# EAGLE schematic FPGA_DENDY_SE (EAGLE 9.4.2)
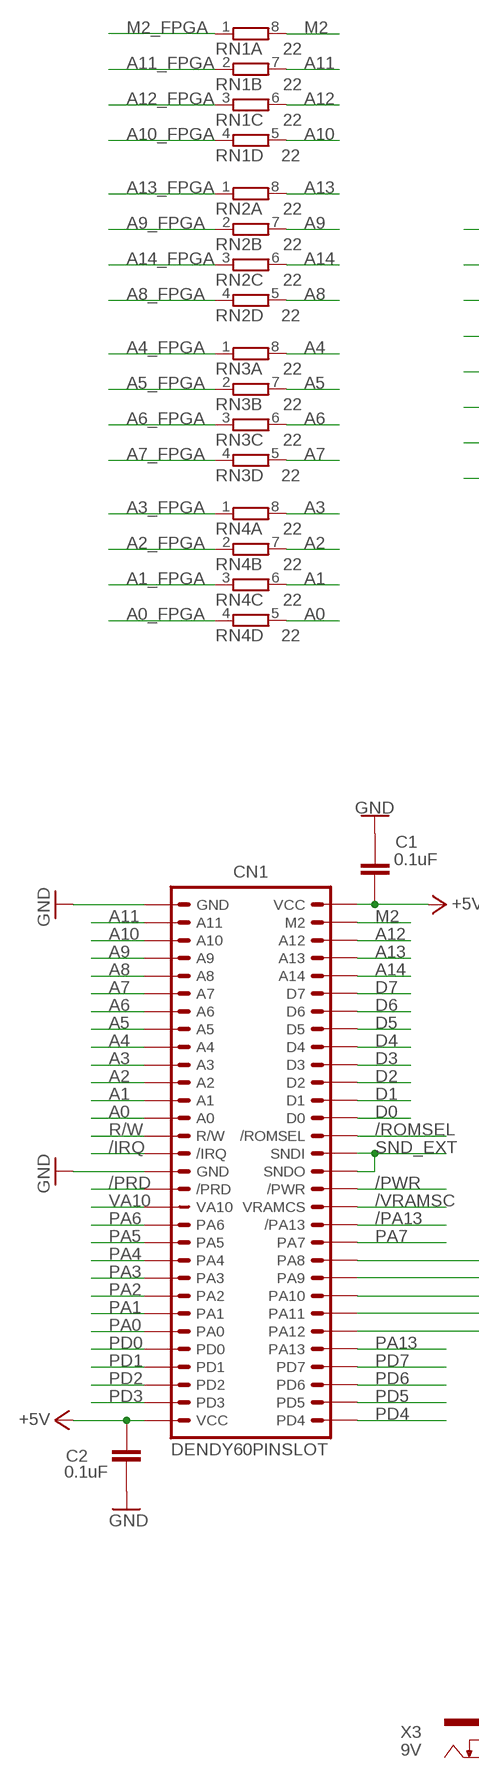
[diagram p0: schematic, sheet 1, part 1 of 2]
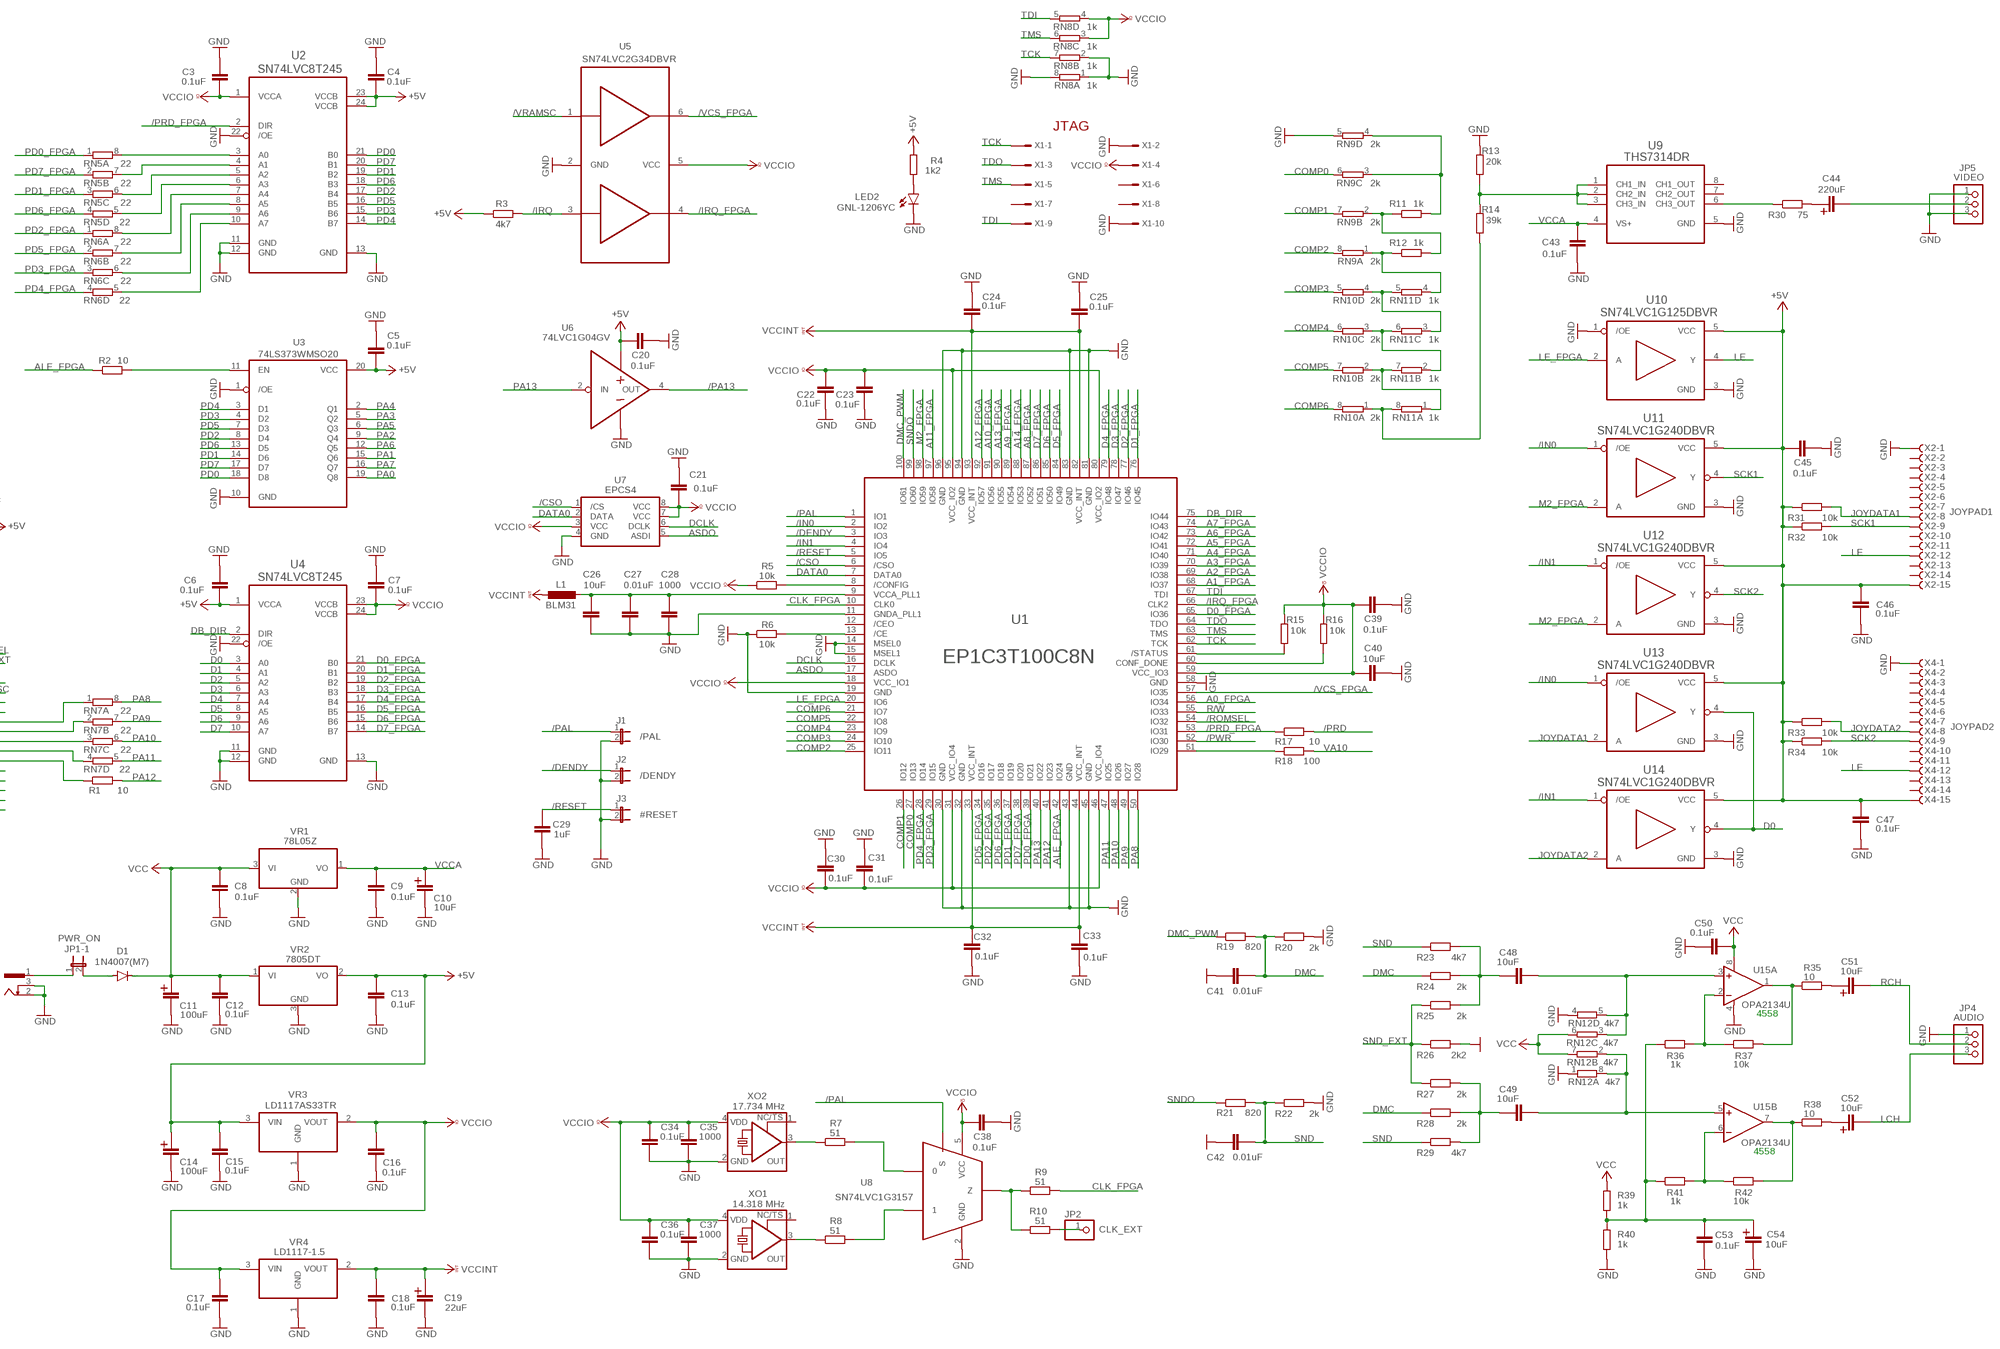
[diagram p1: schematic, sheet 1, part 2 of 2]

## Parts
C1  0.1uF  C-EUC0805  [C0805]
C2  0.1uF  C-EUC0805  [C0805]
C3  0.1uF  C-EUC0805  [C0805]
C4  0.1uF  C-EUC0805  [C0805]
C5  0.1uF  C-EUC0805  [C0805]
C6  0.1uF  C-EUC0603  [C0603]
C7  0.1uF  C-EUC0603  [C0603]
C8  0.1uF  C-EUC0805  [C0805]
C9  0.1uF  C-EUC0805  [C0805]
C10  10uF  CPOL-EU153CLV-0505  [153CLV-0505]
C11  100uF  CPOL-EU153CLV-0505  [153CLV-0505]
C12  0.1uF  C-EUC0805  [C0805]
C13  0.1uF  C-EUC0805  [C0805]
C14  100uF  CPOL-EU153CLV-0505  [153CLV-0505]
C15  0.1uF  C-EUC0805  [C0805]
C16  0.1uF  C-EUC0805  [C0805]
C17  0.1uF  C-EUC0805  [C0805]
C18  0.1uF  C-EUC0805  [C0805]
C19  22uF  CPOL-EU153CLV-0505  [153CLV-0505]
C20  0.1uF  C-EUC0603  [C0603]
C21  0.1uF  C-EUC0603  [C0603]
C22  0.1uF  C-EUC0603  [C0603]
C23  0.1uF  C-EUC0603  [C0603]
C24  0.1uF  C-EUC0603  [C0603]
C25  0.1uF  C-EUC0603  [C0603]
C26  10uF  C-EUC0603  [C0603]
C27  0.01uF  C-EUC0603  [C0603]
C28  1000  C-EUC0603  [C0603]
C29  1uF  C-EUC0603  [C0603]
C30  0.1uF  C-EUC0603  [C0603]
C31  0.1uF  C-EUC0603  [C0603]
C32  0.1uF  C-EUC0603  [C0603]
C33  0.1uF  C-EUC0603  [C0603]
C34  0.1uF  C-EUC0805  [C0805]
C35  1000  C-EUC0805  [C0805]
C36  0.1uF  C-EUC0805  [C0805]
C37  1000  C-EUC0805  [C0805]
C38  0.1uF  C-EUC0603  [C0603]
C39  0.1uF  C-EUC0603  [C0603]
C40  10uF  C-EUC0603  [C0603]
C41  0.01uF  C-EUC0805  [C0805]
C42  0.01uF  C-EUC0805  [C0805]
C43  0.1uF  C-EUC0603  [C0603]
C44  220uF  CPOL-EU153CLV-0505  [153CLV-0505]
C45  0.1uF  C-EUC0603  [C0603]
C46  0.1uF  C-EUC0805  [C0805]
C47  0.1uF  C-EUC0805  [C0805]
C48  10uF  C-EUC0805  [C0805]
C49  10uF  C-EUC0805  [C0805]
C50  0.1uF  C-EUC0805  [C0805]
C51  10uF  CPOL-EU153CLV-0505  [153CLV-0505]
C52  10uF  CPOL-EU153CLV-0505  [153CLV-0505]
C53  0.1uF  C-EUC0805  [C0805]
C54  10uF  CPOL-EU153CLV-0505  [153CLV-0505]
CN1  DENDY60PINSLOT  [60PINDENDY]
D1  1N4007(M7)  DIODE-DO-214AC  [DO-214AC]
J1  /PAL  JP1E  [JP1]
J2  /DENDY  JP1E  [JP1]
J3  #RESET  JP1E  [JP1]
JP1  PWR_ON  JP4QE  [JP4Q]
JP2  CLK_EXT  PINHD-1X1  [1X01]
JP4  AUDIO  PINHD-1X3  [1X03]
JP5  VIDEO  PINHD-1X3  [1X03]
L1  BLM31  L-EUL0201  [L0201]
LED2  GNL-1206YC  LEDSML1206  [SML1206]
R1  10  R-EU_R0805  [R0805]
R2  10  R-EU_R0805  [R0805]
R3  4k7  R-EU_R0805  [R0805]
R4  1k2  R-EU_R0805  [R0805]
R5  10k  R-EU_R0805  [R0805]
R6  10k  R-EU_R0805  [R0805]
R7  51  R-EU_R0805  [R0805]
R8  51  R-EU_R0805  [R0805]
R9  51  R-EU_R0805  [R0805]
R10  51  R-EU_R0805  [R0805]
R11  1k  R-EU_R0805  [R0805]
R12  1k  R-EU_R0805  [R0805]
R13  20k  R-EU_R0805  [R0805]
R14  39k  R-EU_R0805  [R0805]
R15  10k  R-EU_R0805  [R0805]
R16  10k  R-EU_R0805  [R0805]
R17  10  R-EU_R0805  [R0805]
R18  100  R-EU_R0805  [R0805]
R19  820  R-EU_R0805  [R0805]
R20  2k  R-EU_R0805  [R0805]
R21  820  R-EU_R0805  [R0805]
R22  2k  R-EU_R0805  [R0805]
R23  4k7  R-EU_R0805  [R0805]
R24  2k  R-EU_R0805  [R0805]
R25  2k  R-EU_R0805  [R0805]
R26  2k2  R-EU_R0805  [R0805]
R27  2k  R-EU_R0805  [R0805]
R28  2k  R-EU_R0805  [R0805]
R29  4k7  R-EU_R0805  [R0805]
R30  75  R-EU_R0805  [R0805]
R31  10k  R-EU_R0805  [R0805]
R32  10k  R-EU_R0805  [R0805]
R33  10k  R-EU_R0805  [R0805]
R34  10k  R-EU_R0805  [R0805]
R35  10  R-EU_R0805  [R0805]
R36  1k  R-EU_R0805  [R0805]
R37  10k  R-EU_R0805  [R0805]
R38  10  R-EU_R0805  [R0805]
R39  1k  R-EU_R0805  [R0805]
R40  1k  R-EU_R0805  [R0805]
R41  1k  R-EU_R0805  [R0805]
R42  10k  R-EU_R0805  [R0805]
RN1  22  4R-N0603-ARC  [0603-ARC]
RN2  22  4R-N0603-ARC  [0603-ARC]
RN3  22  4R-N0603-ARC  [0603-ARC]
RN4  22  4R-N0603-ARC  [0603-ARC]
RN5  22  4R-N0603-ARC  [0603-ARC]
RN6  22  4R-N0603-ARC  [0603-ARC]
RN7  22  4R-N0603-ARC  [0603-ARC]
RN8  1k  4R-N0603-ARC  [0603-ARC]
RN9  2k  4R-N0603-ARC  [0603-ARC]
RN10  2k  4R-N0603-ARC  [0603-ARC]
RN11  1k  4R-N0603-ARC  [0603-ARC]
RN12  4k7  4R-N0603-ARC  [0603-ARC]
U1  EP1C3T100C8N  [QFP50P1600X1600X120-100N]
U2  SN74LVC8T245  [SOP65P640X110-24N]
U3  74LS373WMSO20  [SO20W]
U4  SN74LVC8T245  [SOP65P640X110-24N]
U5  SN74LVC2G34DBVR  [SOT-23-6]
U6  74LVC1G04GV  [SOT95P275X110-5N]
U7  EPCS4  [SO08]
U8  SN74LVC1G3157  [SOT-23-6]
U9  THS7314DR  THS7314  [SO8]
U10  SN74LVC1G125DBVR  [SOT95P280X145-5N]
U11  SN74LVC1G240DBVR  [SOT95P280X145-5N]
U12  SN74LVC1G240DBVR  [SOT95P280X145-5N]
U13  SN74LVC1G240DBVR  [SOT95P280X145-5N]
U14  SN74LVC1G240DBVR  [SOT95P280X145-5N]
U15  OPA2134U  [SO08]
VR1  78L05Z  [TO92]
VR2  7805DT  [TO252]
VR3  LD1117AS33TR  [SOT230P700X180-4N]
VR4  LD1117-1.5  [SOT-223-3]
X1  057-010-1  [057-010-1]
X2  JOYPAD1  F15HPS  [F15HP]
X3  9V  733980-62  [733980-62]
X4  JOYPAD2  F15HPS  [F15HP]
XO1  14.318 MHz  KXO-PXO/XO-V97  [7.0X5.08_KXO-(V)97]
XO2  17.734 MHz  KXO-PXO/XO-V95  [2.5X2.0_KXO-V95]

## Nets
+5V: C1.2 C2.1 C4.2 C5.2 C6.1 C13.1 C14.+ C15.1 C20.2 C45.2 C46.1 C47.1 CN1.A30(VCC) CN1.B1(VCC) R3.1 R4.2 R31.1 R32.1 R33.1 R34.1 U2.23(VCCB) U2.24(VCCB) U3.20(VCC) U4.1(VCCA) U6.5(VCC) U10.5(VCC) U11.5(VCC) U12.5(VCC) U13.5(VCC) U14.5(VCC) VR2.2(VO) VR3.3(VIN) X2.15(-15:F) X4.15(-15:F)
/CSO: U1.6(/CSO) U7.1(/CS)
/DENDY: J2.1 U1.3(IO3)
/IN0: U1.2(IO2) U11.1(/OE) U13.1(/OE)
/IN1: U1.4(IO4) U12.1(/OE) U14.1(/OE)
/IRQ: CN1.A15(/IRQ) R3.2 U5.3(IN2)
/IRQ_FPGA: U1.66(CLK2) U5.4(OUT2)
/PA13: CN1.B19(/PA13) U6.4(OUT)
/PAL: J1.1 U1.1(IO1) U8.6(S)
/PRD: CN1.A17(/PRD) R17.2
/PRD_FPGA: R17.1 U1.53(IO31) U2.2(DIR)
/PWR: CN1.B17(/PWR) U1.52(IO30)
/PWR_FPGA: R18.1 U1.51(IO29)
/RESET: C29.2 J3.1 U1.5(IO5)
/ROMSEL: CN1.B14(/ROMSEL) U1.54(IO32)
/VCS_FPGA: U1.57(IO35) U5.6(OUT1)
/VRAMSC: CN1.B18(VRAMCS) U5.1(IN1)
A0: CN1.A13(A0) RN4.5
A0_FPGA: RN4.4 U1.56(IO34)
A1: CN1.A12(A1) RN4.6
A1_FPGA: RN4.3 U1.68(IO37)
A2: CN1.A11(A2) RN4.7
A2_FPGA: RN4.2 U1.69(IO38)
A3: CN1.A10(A3) RN4.8
A3_FPGA: RN4.1 U1.70(IO39)
A4: CN1.A9(A4) RN3.8
A4_FPGA: RN3.1 U1.71(IO40)
A5: CN1.A8(A5) RN3.7
A5_FPGA: RN3.2 U1.72(IO41)
A6: CN1.A7(A6) RN3.6
A6_FPGA: RN3.3 U1.73(IO42)
A7: CN1.A6(A7) RN3.5
A7_FPGA: RN3.4 U1.74(IO43)
A8: CN1.A5(A8) RN2.5
A8_FPGA: RN2.4 U1.87(IO52)
A9: CN1.A4(A9) RN2.7
A9_FPGA: RN2.2 U1.89(IO54)
A10: CN1.A3(A10) RN1.5
A10_FPGA: RN1.4 U1.91(IO56)
A11: CN1.A2(A11) RN1.7
A11_FPGA: RN1.2 U1.97(IO58)
A12: CN1.B3(A12) RN1.6
A12_FPGA: RN1.3 U1.92(IO57)
A13: CN1.B4(A13) RN2.8
A13_FPGA: RN2.1 U1.90(IO55)
A14: CN1.B5(A14) RN2.6
A14_FPGA: RN2.3 U1.88(IO53)
ALE_FPGA: R2.1 U1.42(IO24)
ASDO: U1.17(ASDO) U7.5(ASDI)
CLK_FPGA: R9.2 U1.10(CLK0)
COMP0: RN9.6 U1.27(IO13)
COMP1: RN9.7 U1.26(IO12)
COMP2: RN9.8 U1.25(IO11)
COMP3: RN10.5 U1.24(IO10)
COMP4: RN10.6 U1.23(IO9)
COMP5: RN10.7 U1.22(IO8)
COMP6: RN10.8 U1.21(IO7)
D0: CN1.B13(D0) U4.3(A0) U13.4(Y) U14.4(Y)
D0_FPGA: U1.65(IO36) U4.21(B0)
D1: CN1.B12(D1) U4.4(A1)
D1_FPGA: U1.76(IO45) U4.20(B1)
D2: CN1.B11(D2) U4.5(A2)
D2_FPGA: U1.77(IO46) U4.19(B2)
D3: CN1.B10(D3) U4.6(A3)
D3_FPGA: U1.78(IO47) U4.18(B3)
D4: CN1.B9(D4) U4.7(A4)
D4_FPGA: U1.79(IO48) U4.17(B4)
D5: CN1.B8(D5) U4.8(A5)
D5_FPGA: U1.84(IO49) U4.16(B5)
D6: CN1.B7(D6) U4.9(A6)
D6_FPGA: U1.85(IO50) U4.15(B6)
D7: CN1.B6(D7) U4.10(A7)
D7_FPGA: U1.86(IO51) U4.14(B7)
DATA0: U1.7(DATA0) U7.2(DATA)
DB_DIR: U1.75(IO44) U4.2(DIR)
DCLK: U1.16(DCLK) U7.6(DCLK)
DMC: C41.2 R19.2 R20.1 R24.1 R28.1
DMC_PWM: R19.1 U1.100(IO61)
GND: C1.1 C2.2 C3.1 C4.1 C5.1 C6.2 C7.2 C8.2 C9.2 C10.- C11.- C12.2 C13.2 C14.- C15.2 C16.2 C17.2 C18.2 C19.- C20.1 C21.2 C22.1 C23.1 C24.2 C25.2 C26.1 C27.1 C28.1 C29.1 C30.2 C31.2 C32.1 C33.1 C34.2 C35.2 C36.2 C37.2 C38.1 C39.1 C40.1 C41.1 C42.1 C43.1 C45.1 C46.2 C47.2 C50.1 C53.2 C54.- CN1.A1(GND) CN1.A16(GND) J1.2 J2.2 J3.2 JP4.1 JP5.1 JP5.3 LED2.C R6.1 R13.2 R20.2 R22.2 R26.2 R40.2 RN8.1 RN8.2 RN8.8 RN9.5 RN12.1 RN12.4 U1.11(GNDA_PLL1) U1.14(MSEL0) U1.15(MSEL1) U1.19(GND) U1.30(GND) U1.32(GND) U1.43(GND) U1.45(GND) U1.58(GND) U1.81(GND) U1.83(GND) U1.94(GND) U1.96(GND) U2.11(GND) U2.12(GND) U2.13(GND) U2.22(/OE) U3.1(/OE) U3.10(GND) U4.11(GND) U4.12(GND) U4.13(GND) U4.22(/OE) U5.2(GND) U6.3(GND) U7.4(GND) U8.2(GND) U9.5(GND) U10.1(/OE) U10.3(GND) U11.3(GND) U12.3(GND) U13.3(GND) U14.3(GND) U15.4(A:V-) VR1.2(GND) VR2.3(GND) VR3.1(GND) VR4.1(GND) X1.2 X1.10 X2.1(-1:F) X3.2 X3.3 X4.1(-1:F) XO1.2(GND) XO2.2(GND)
JOYDATA1: R31.2 U13.2(A) X2.8(-8:F)
JOYDATA2: R33.2 U14.2(A) X4.8(-8:F)
LCH: C52.- JP4.3
LE: U10.4(Y) X2.12(-12:F) X4.12(-12:F)
LE_FPGA: U1.20(IO6) U10.2(A)
M2: CN1.B2(M2) RN1.8
M2_FPGA: RN1.1 U1.98(IO59) U11.2(A) U12.2(A)
N$1: R15.1 U1.61(/STATUS)
N$2: R16.1 U1.60(CONF_DONE)
N$3: JP2.1 R10.2
N$4: RN10.2 RN11.1 RN11.7
N$5: R11.2 RN9.3 RN9.4
N$6: R2.2 U3.11(EN)
N$7: RN5.8 U2.3(A0)
N$8: R12.1 RN9.1 RN11.4
N$9: RN10.3 RN11.2 RN11.6
N$10: R6.2 U1.13(/CE)
N$11: R5.2 U1.8(/CONFIG)
N$12: C26.2 C27.2 C28.2 L1.2 U1.9(VCCA_PLL1)
N$13: C52.+ R38.2
N$14: R41.2 R42.1 U15.6(B:-IN)
N$15: D1.A JP1.2
N$16: C48.1 R23.2 R24.2 R25.2
N$17: R8.1 XO1.3(OUT)
N$18: R7.1 XO2.3(OUT)
N$19: RN5.7 U2.4(A1)
N$20: RN5.6 U2.5(A2)
N$21: RN5.5 U2.6(A3)
N$22: RN6.8 U2.7(A4)
N$23: RN6.7 U2.8(A5)
N$24: RN6.6 U2.9(A6)
N$25: RN6.5 U2.10(A7)
N$26: R11.1 R12.2 RN9.2
N$27: CN1.B21(PA8) RN7.1
N$28: R14.1 RN10.1 RN11.8
N$29: CN1.B22(PA9) RN7.2
N$30: C49.1 R27.2 R28.2 R29.2
N$31: CN1.B23(PA10) RN7.3
N$32: CN1.B24(PA11) RN7.4
N$33: CN1.B25(PA12) R1.1
N$34: R30.1 U9.6(CH3_OUT)
N$35: R7.2 U8.3
N$36: C44.+ R30.2
N$37: C51.+ R35.2
N$38: C48.2 RN12.3 RN12.5 U15.3(A:+IN)
N$39: C49.2 RN12.2 RN12.8 U15.5(B:+IN)
N$40: RN10.4 RN11.3 RN11.5
N$41: R13.1 R14.2 U9.1(CH1_IN) U9.2(CH2_IN) U9.3(CH3_IN)
N$42: R36.2 R37.1 U15.2(A:-IN)
N$43: R35.1 R37.2 U15.1(A:OUT)
N$44: R38.1 R42.2 U15.7(B:OUT)
N$45: C44.- JP5.2
N$46: R8.2 U8.1
N$47: R9.1 R10.1 U8.4(Z)
N$63: LED2.A R4.1
N$77: JP1.1 X3.1
PA0: CN1.A25(PA0) U3.19(Q8)
PA1: CN1.A24(PA1) U3.15(Q6)
PA2: CN1.A23(PA2) U3.9(Q4)
PA3: CN1.A22(PA3) U3.5(Q2)
PA4: CN1.A21(PA4) U3.2(Q1)
PA5: CN1.A20(PA5) U3.6(Q3)
PA6: CN1.A19(PA6) U3.12(Q5)
PA7: CN1.B20(PA7) U3.16(Q7)
PA8: RN7.8 U1.50(IO28)
PA9: RN7.7 U1.49(IO27)
PA10: RN7.6 U1.48(IO26)
PA11: RN7.5 U1.47(IO25)
PA12: R1.2 U1.41(IO23)
PA13: CN1.B26(PA13) U1.40(IO22) U6.2(IN)
PD0: CN1.A26(PD0) U2.21(B0) U3.18(D8)
PD0_FPGA: RN5.1 U1.39(IO21)
PD1: CN1.A27(PD1) U2.19(B2) U3.14(D6)
PD1_FPGA: RN5.3 U1.37(IO19)
PD2: CN1.A28(PD2) U2.17(B4) U3.8(D4)
PD2_FPGA: RN6.1 U1.35(IO17)
PD3: CN1.A29(PD3) U2.15(B6) U3.4(D2)
PD3_FPGA: RN6.3 U1.29(IO15)
PD4: CN1.B30(PD4) U2.14(B7) U3.3(D1)
PD4_FPGA: RN6.4 U1.28(IO14)
PD5: CN1.B29(PD5) U2.16(B5) U3.7(D3)
PD5_FPGA: RN6.2 U1.34(IO16)
PD6: CN1.B28(PD6) U2.18(B3) U3.13(D5)
PD6_FPGA: RN5.4 U1.36(IO18)
PD7: CN1.B27(PD7) U2.20(B1) U3.17(D7)
PD7_FPGA: RN5.2 U1.38(IO20)
R/W: CN1.A14(R/W) U1.55(IO33)
RCH: C51.- JP4.2
SCK1: R32.2 U11.4(Y) X2.9(-9:F)
SCK2: R34.2 U12.4(Y) X4.9(-9:F)
SND: C42.2 R21.2 R22.1 R23.1 R29.1
SND_EXT: CN1.B15(SNDI) CN1.B16(SNDO) R25.1 R26.1 R27.1
SNDO: R21.1 U1.99(IO60)
TCK: RN8.7 U1.62(TCK) X1.1
TDI: RN8.5 U1.67(TDI) X1.9
TDO: U1.64(TDO) X1.3
TMS: RN8.6 U1.63(TMS) X1.5
VA10: CN1.A18(VA10) R18.2
VCC: C8.1 C11.+ C12.1 C50.2 D1.C R39.1 RN12.6 RN12.7 U15.8(A:V+) VR1.3(VI) VR2.1(VI)
VCCA: C9.1 C10.+ C43.2 U9.4(VS+) VR1.1(VO)
VCCINT: C18.1 C19.+ C24.1 C25.1 C32.2 C33.2 L1.1 U1.33(VCC_INT) U1.44(VCC_INT) U1.82(VCC_INT) U1.93(VCC_INT) VR4.2(VOUT)
VCCIO: C3.2 C7.1 C16.1 C17.1 C21.1 C22.2 C23.2 C30.1 C31.1 C34.1 C35.1 C36.1 C37.1 C38.2 C39.2 C40.2 R5.1 R15.2 R16.2 RN8.3 RN8.4 U1.18(VCC_IO1) U1.31(VCC_IO4) U1.46(VCC_IO4) U1.59(VCC_IO3) U1.80(VCC_IO2) U1.95(VCC_IO2) U2.1(VCCA) U4.23(VCCB) U4.24(VCCB) U5.5(VCC) U7.3(VCC) U7.7(VCC) U7.8(VCC) U8.5(VCC) VR3.2(VOUT) VR4.3(VIN) X1.4 XO1.4(VDD) XO2.4(VDD)
VPPL3: C53.1 C54.+ R36.1 R39.2 R40.1 R41.1
Unconnected: JP1.3 JP1.4 JP1.5 JP1.6 JP1.7 JP1.8 U1.12(/CEO) U9.7(CH2_OUT) U9.8(CH1_OUT) X1.6 X1.7 X1.8 X2.2(-2:F) X2.3(-3:F) X2.4(-4:F) X2.5(-5:F) X2.6(-6:F) X2.7(-7:F) X2.10(-10:F) X2.11(-11:F) X2.13(-13:F) X2.14(-14:F) X2.G1(-G:G1) X2.G2(-G:G2) X4.2(-2:F) X4.3(-3:F) X4.4(-4:F) X4.5(-5:F) X4.6(-6:F) X4.7(-7:F) X4.10(-10:F) X4.11(-11:F) X4.13(-13:F) X4.14(-14:F) X4.G1(-G:G1) X4.G2(-G:G2) XO1.1(TS) XO2.1(TS)

## Notes on the sheet
- JTAG
- 4558
- 4558

## Library data of the parts
C1-C9 C12 C13 C15-C18 C20-C43 C45-C50 C53 = rcl_my:C-EU: CAPACITOR, European symbol; SPICEPREFIX: C
C10 C11 C14 C19 C44 C51 C52 C54 = rcl_my:CPOL-EU: POLARIZED CAPACITOR, European symbol; SPICEPREFIX: C
CN1 = DENDY60pin:DENDY60PINSLOT
D1 = diode:DIODE-: DIODE
J1-J3 = jumper:JP1E: JUMPER
JP1 = jumper:JP4QE: JUMPER
JP2 = pinhead:PINHD-1X1: PIN HEADER
JP4 JP5 = pinhead:PINHD-1X3: PIN HEADER
L1 = rcl_my:L-EU: INDUCTOR, European symbol; SPICEPREFIX: L
LED2 = led:LED: LED OSRAM: - CHIPLED LG R971, LG N971, LY N971, LG Q971, LY Q971, LO R971, LY R971 LH N974, LH R974 LS Q976, LO Q976, LY Q976 LO Q996 - Hyper CHIPLED LW Q18S LB Q993, LB Q99A, LB R99A - SideLED LS A670, LO A670, LY A670, LG A670, LP A670 LB A673, LV A673, LT A673, LW A673 LH A674 LY A675 LS A676, LA A676, LO A676, LY A676, LW A676 LS A679, LY A679, LG A679 - Hyper Micro SIDELED® LS Y876, LA Y876, LO Y876, LY Y876 LT Y87S - SmartLED LW L88C, LW L88S LB L89C, LB L89S, LG L890 LS L89K, LO L89K, LY L89K LS L896, LA L896, LO L896, LY L896 - TOPLED LS T670, LO T670, LY T670, LG T670, LP T670 LSG T670, LSP T670, LSY T670, LOP T670, LYG T670 LG T671, LOG T671, LSG T671 LB T673, LV T673, LT T673, LW T673 LH T674 LS T676, LA T676, LO T676, LY T676, LB T676, LH T676, LSB T676, LW T676 LB T67C, LV T67C, LT T67C, LS T67K, LO T67K, LY T67K, LW E67C LS E67B, LA E67B, LO E67B, LY E67B, LB E67C, LV E67C, LT E67C LW T67C LS T679, LY T679, LG T679 LS T770, LO T770, LY T770, LG T770, LP T770 LB T773, LV T773, LT T773, LW T773 LH T774 LS E675, LA E675, LY E675, LS T675 LS T776, LA T776, LO T776, LY T776, LB T776 LHGB T686 LT T68C, LB T68C - Hyper Mini TOPLED® LB M676 - Mini TOPLED Santana® LG M470 LS M47K, LO M47K, LY M47K Source: http://www.osram.convergy.de LUXEON: - LUMILED® LXK2-PW12-R00, LXK2-PW12-S00, LXK2-PW14-U00, LXK2-PW14-V00 LXK2-PM12-R00, LXK2-PM12-S00, LXK2-PM14-U00 LXK2-PE12-Q00, LXK2-PE12-R00, LXK2-PE12-S00, LXK2-PE14-T00, LXK2-PE14-U00 LXK2-PB12-K00, LXK2-PB12-L00, LXK2-PB12-M00, LXK2-PB14-N00, LXK2-PB14-P00, LXK2-PB14-Q00 LXK2-PR12-L00, LXK2-PR12-M00, LXK2-PR14-Q00, LXK2-PR14-R00 LXK2-PD12-Q00, LXK2-PD12-R00, LXK2-PD12-S00 LXK2-PH12-R00, LXK2-PH12-S00 LXK2-PL12-P00, LXK2-PL12-Q00, LXK2-PL12-R00 Source: www.luxeon.com KINGBRIGHT: KA-3528ASYC Source: www.kingbright.com
R1-R42 = rcl:R-EU_: RESISTOR, European symbol; SPICEPREFIX: R
RN1-RN12 = resistor-dil:4R-N: Array Chip Resistor Source: RS Component / Phycomp; OC_FARNELL: unknown; OC_NEWARK: unknown
U1 = EP1C3T100C8N:EP1C3T100C8N
U2 U4 = SN74LVC8T245:SN74LVC8T245
U3 = 74LS373WM:74LS373WM
U5 = SN74LVC2G34DBVR:SN74LVC2G34DBVR
U6 = 74LVC1G04GV:74LVC1G04GV
U7 = EPCS4:EPCS4
U8 = SN74LVC1G3157:SN74LVC1G3157
U9 = THS7314DR:THS7314
U10 = SN74LVC1G125DBVR:SN74LVC1G125DBVR
U11-U14 = SN74LVC1G240DBVR:SN74LVC1G240DBVR
U15 = burr-brown:OPA2134: Operational Amplifier; MF: TEXAS INSTRUMENTS; MPN: OPA2134UA; OC_FARNELL: 1206935; OC_NEWARK: 35C1847
VR1 = linear:78*: Positive VOLTAGE REGULATOR Source: http://cache.national.com/ds/LM/LM78L05.pdf http://www.fairchildsemi.com/ds/LM/LM7805.pdf
VR2 = linear stab:78*: Positive VOLTAGE REGULATOR Source: http://cache.national.com/ds/LM/LM78L05.pdf http://www.fairchildsemi.com/ds/LM/LM7805.pdf
VR3 = LD1117AS33TR:LD1117AS33TR
VR4 = LD1117-1.5:LD1117-1.5
X1 = con-panduit:057-010-: CONNECTOR 10-pin series 057 contact pc board low profile headers; OC_FARNELL: unknown; OC_NEWARK: unknown
X2 X4 = con-subd:F15HPS: SUB-D; OC_FARNELL: unknown; OC_NEWARK: unknown
X3 = con-conrad:73398?: FEMALE PRINT CONNECTOR Niedervolt-Steckverbinder Distributor Conrad
XO1 XO2 = crystal-geyer_V1_0:KXO-PXO/XO-V: Clock Oscillator (PXO/XO) MHz : KXO-V - Serie Model Size l/w/h [mm] Frequency Range Frequency Stability Temp. Range [°C] Output AECQ 200 availabel Datasheet KXO-V94 KXO-V94 KXO-V95 KXO-V95 KXO-V96 KXO-V96 KXO-V99 KXO-V99 KXO-97 KXO-V97 KXO-97 - KXO-V97 2.0/1.6/0.80 2.0/1.6/0.80 2.5/2.0/0.82 2.5/2.0/0.82 3.2/2.5/1.2 3.2/2.5/1.2 5.0/3.2/1.2 5.0/3.2/1.2 7.0/5.08/1.3 7.0/5.08/1.3 7.0/5.08/1.3 32,768 kHz 1,0 ~ 80,0 MHz 32,768 kHz 1,0 ~ 70,0 MHz 32,768 kHz 1,0 ~ 156,0 MHz 32,768 kHz 1,0 ~ 200,0 MHz 32,768 kHz 32,768 kHz 1,0 ~ 160,0 MHz ±25 … ±100ppm ±25 … ±100ppm ±25 … ±100ppm ±25 … ±100ppm ±25 … ±100ppm ±25 … ±100ppm ±25 … ±100ppm ±25 … ±100ppm ±25 … ±100ppm ±25 … ±100ppm ±25 … ±100ppm (*) -40°C …+85°C (*) -40°C …+85°C (*) -40°C …+85°C (*) -40°C …+85°C (*) -40°C …+85°C (*) -40°C …+85°C (*) -40°C …+85°C (*) -40°C …+85°C (*) -40°C …+85°C (*) -40°C …+85°C (*) -40°C …+85°C HCMOS HCMOS HCMOS HCMOS HCMOS HCMOS HCMOS HCMOS HCMOS HCMOS HCMOS - - yes yes yes yes - - - - - KXO-V94-kHz.pdf <http://www.geyer-electronic.de/uploads/tx_userartikelfrequenz/GEYER-KXO-V94-kHz.pdf> KXO-V94.pdf <http://www.geyer-electronic.de/uploads/tx_userartikelfrequenz/GEYER-KXO-V94.pdf> KXO-V95-kHz.pdf <http://www.geyer-electronic.de/uploads/tx_userartikelfrequenz/GEYER-KXO-V95-kHz.pdf> KXO-V95.pdf <http://www.geyer-electronic.de/uploads/tx_userartikelfrequenz/GEYER-KXO-V95.pdf> KXO-V96-kHz.pdf <http://www.geyer-electronic.de/uploads/tx_userartikelfrequenz/GEYER-KXO-V96-kHz.pdf> KXO-V96.pdf <http://www.geyer-electronic.de/uploads/tx_userartikelfrequenz/GEYER-KXO-V96.pdf> KXO-V99-kHz.pdf <http://www.geyer-electronic.de/uploads/tx_userartikelfrequenz/GEYER-KXO-V99-kHz.pdf> KXO-V99.pdf <http://www.geyer-electronic.de/uploads/tx_userartikelfrequenz/GEYER-KXO-V99.pdf> KXO-97-kHz.pdf <http://www.geyer-electronic.de/uploads/tx_userartikelfrequenz/GEYER-KXO-97-kHz.pdf> KXO-V97-kHz.pdf <http://www.geyer-electronic.de/uploads/tx_userartikelfrequenz/GEYER-KXO-V97-kHz.pdf> KXO-V97.pdf <http://www.geyer-electronic.de/uploads/tx_userartikelfrequenz/GEYER-KXO-V97.pdf> <http://www.geyer-electronic.de/fileadmin/template/img/logo-geyer-electronic.png> Details see: http://www.geyer-electronic.de/Frequenz-Produkte.9.0.html Created 2016-06-07, Hans Locher 2016 (C) Geyer Quartz Technology Hans Locher KXOV94,KXOV95;KXOV96;KXOV97;KXO97;2016;2520;3225;5032;70508;2,5x2,0;3,2x2,5;5,0x3,2;7,0x5,08;2.5x2.0;3.2x2.5;5.0x3.2;7.0x5.08;